# Altium schematic sheet Sheet2 .SchDoc
size A2; SheetNumber: 1; SheetTotal: 1; SPICEModelCacheZPAMZGEW: <root> / <DocumentId>ZPAMZGEW</DocumentId> / </root>
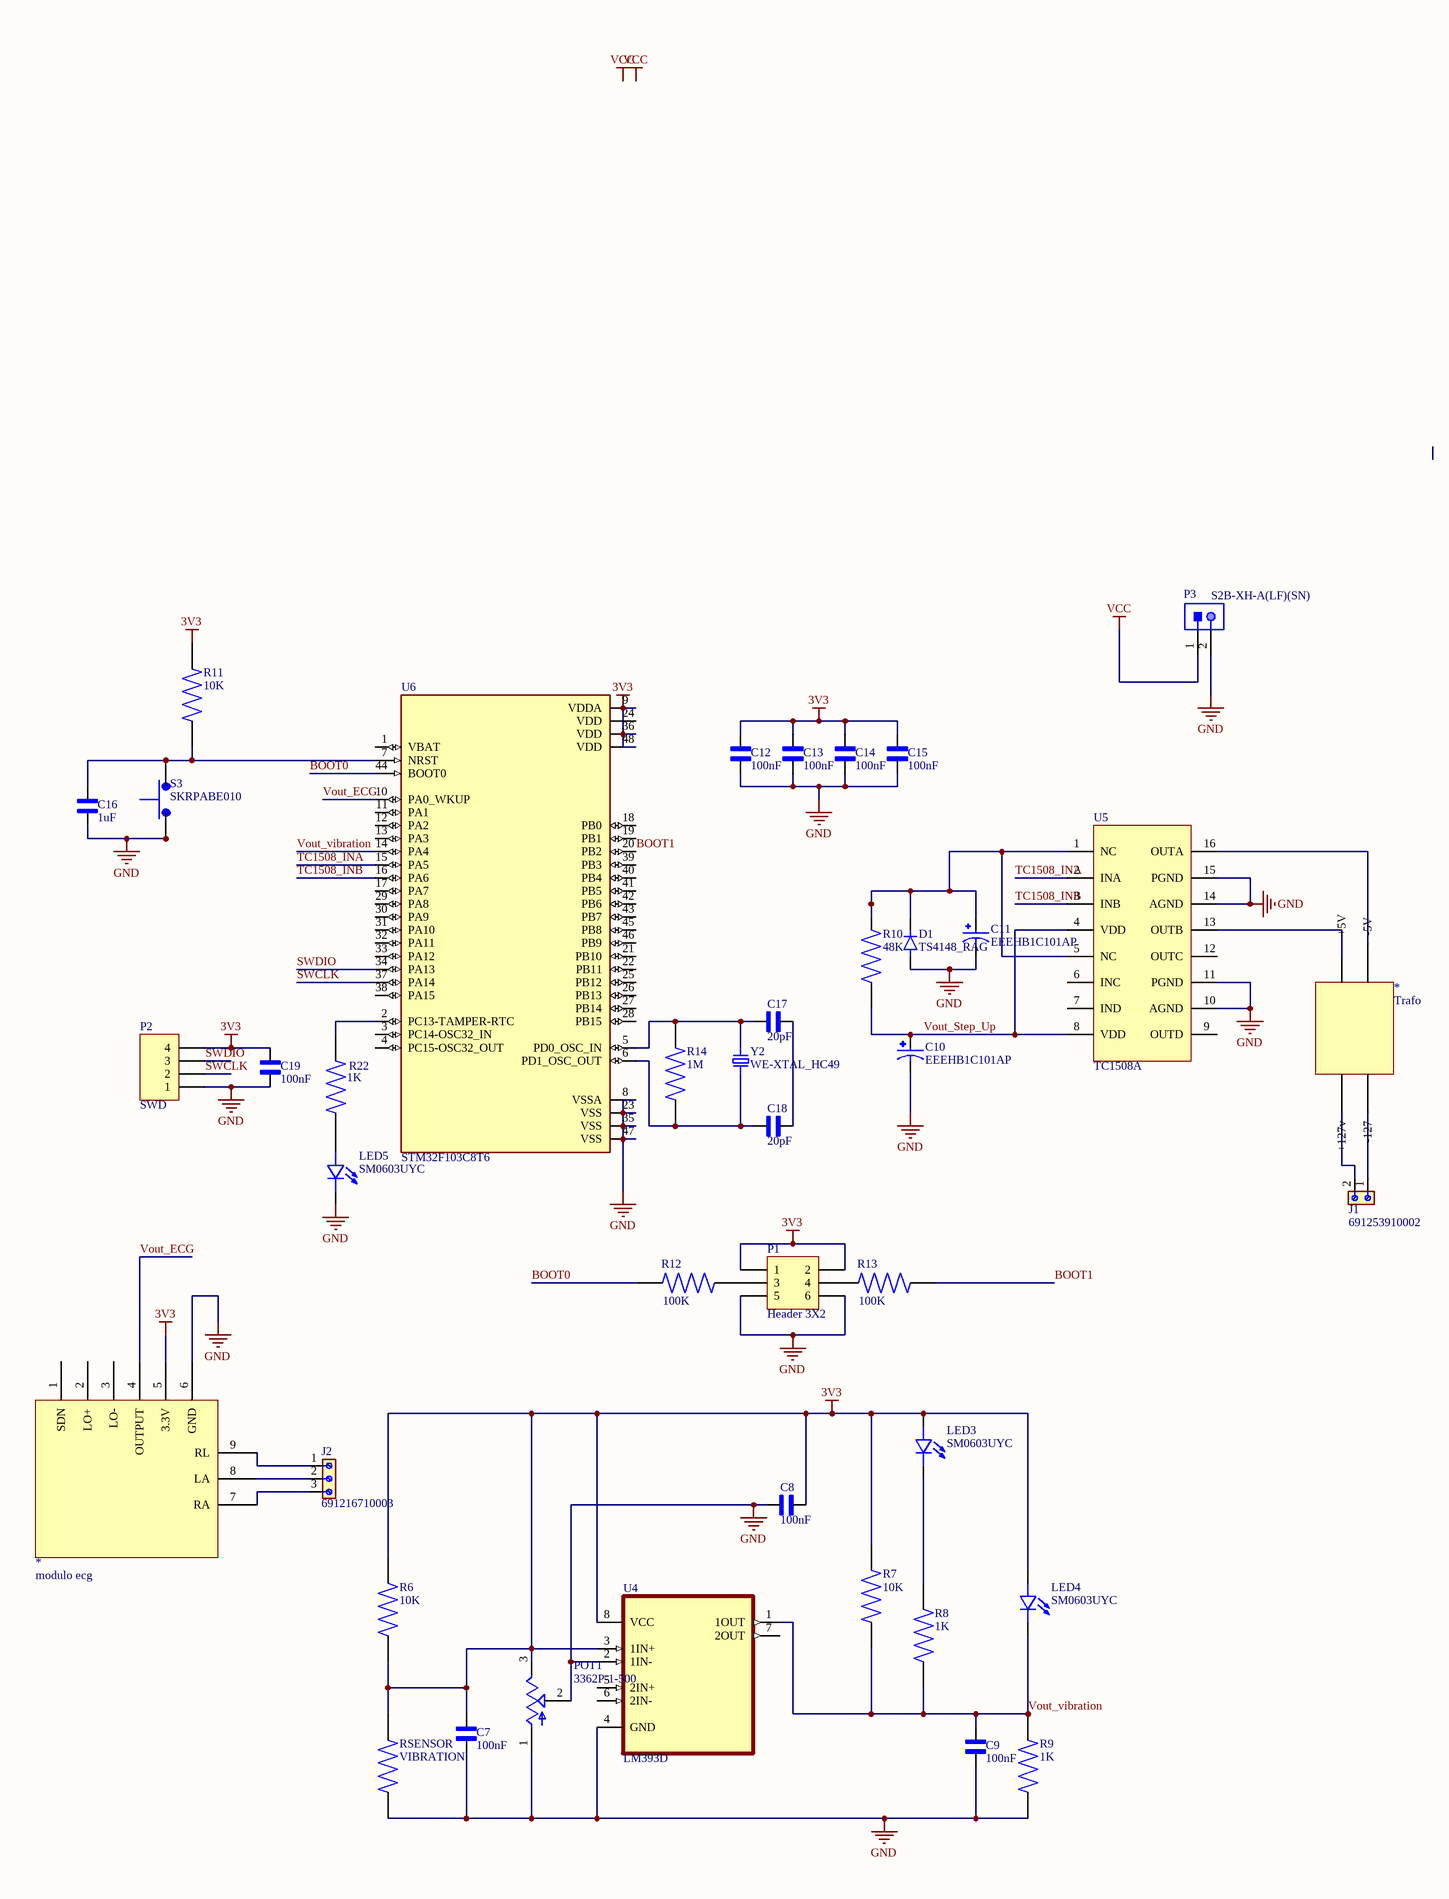
[diagram p0: Sheet2 .SchDoc, left]
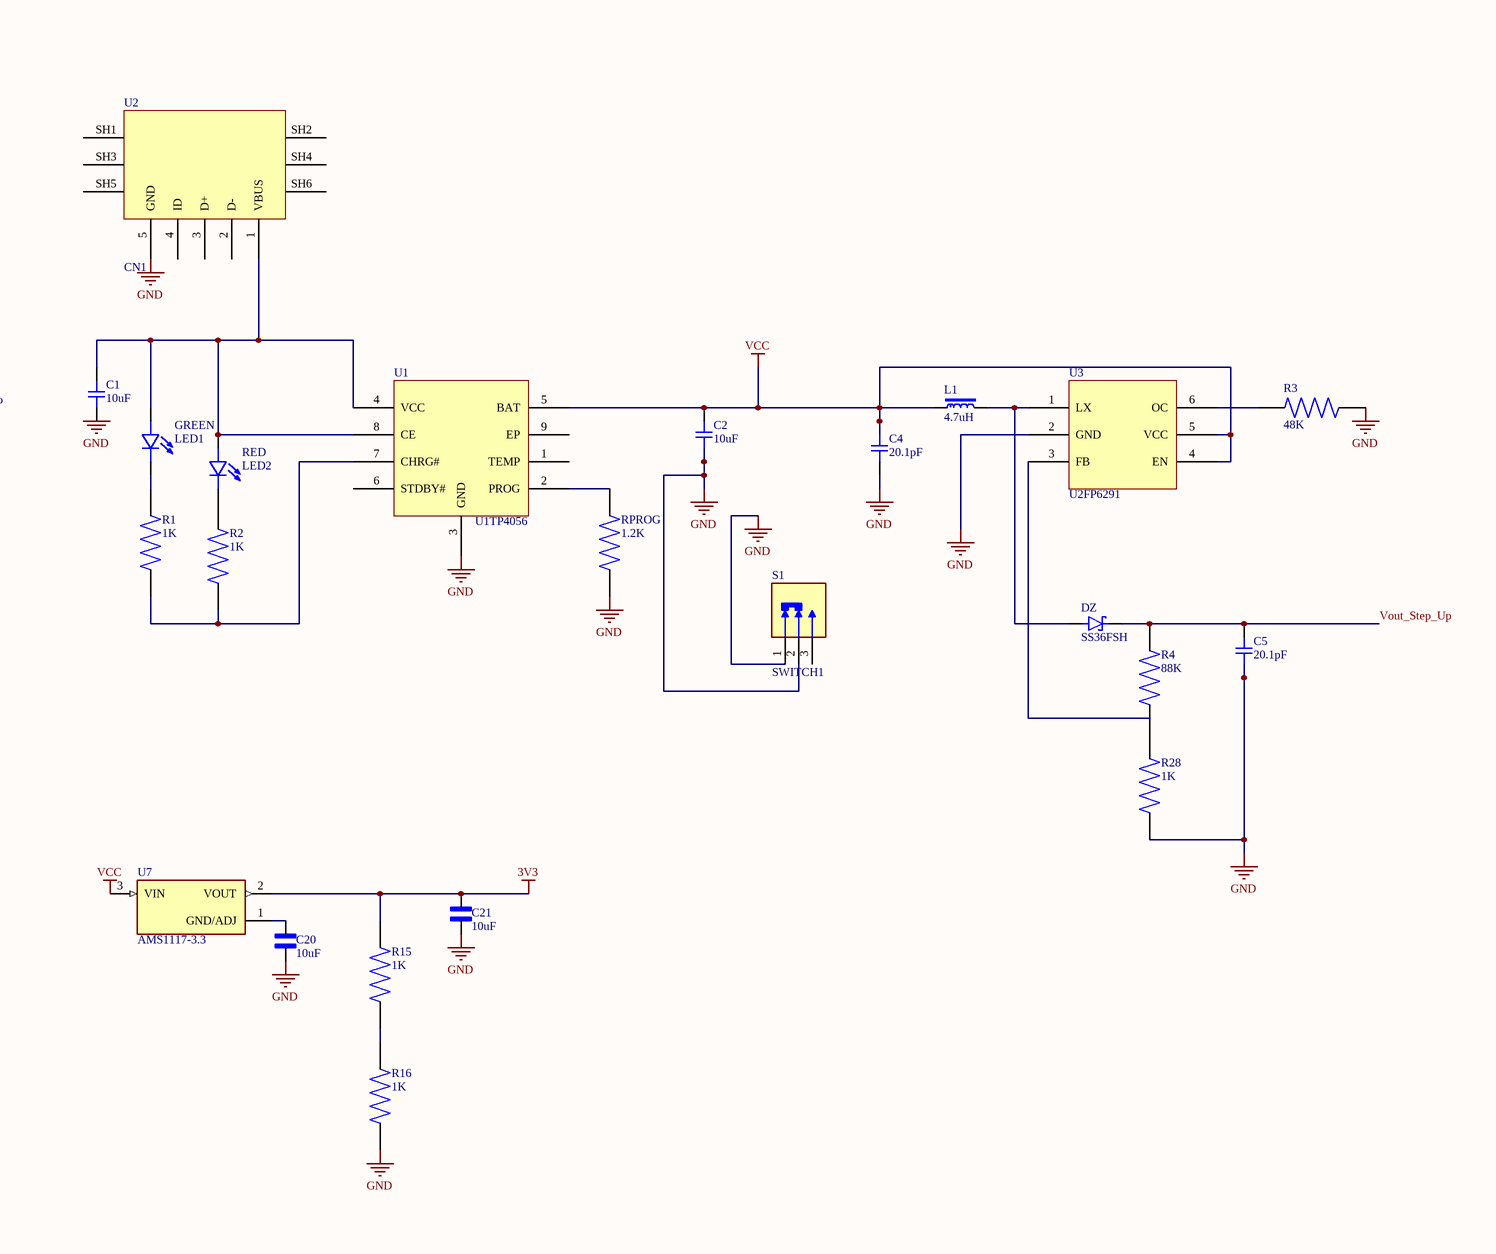
[diagram p1: Sheet2 .SchDoc, right]

## Parts
(Parts that share a designator on the sheet are numbered #1, #2 ... from top to bottom, then left to right.)
*#1  Trafo
*#2  modulo ecg  [MODULE_SEN-12650]
C1  10uF  [CAPC3216X190N]
C2  10uF  [CAPC3216X190N]
C4  20.1pF  [CAPC3216X190N]
C5  20.1pF  [CAPC3216X190N]
C7  100nF  [CAPC2012X94N]
C8  100nF  [CAPC2012X94N]
C9  100nF  [CAPC2012X94N]
C10  EEEHB1C101AP  [EHB1C10A3]
C11  EEEHB1C101AP  [EHB1C10A3]
C12  100nF  [CAPC2012X94N]
C13  100nF  [CAPC2012X94N]
C14  100nF  [CAPC2012X94N]
C15  100nF  [CAPC2012X94N]
C16  1uF  [CAPC2012X94N]
C17  20pF  [CAPC2012X94N]
C18  20pF  [CAPC2012X94N]
C19  100nF  [CAPC2012X94N]
C20  10uF  [CAPC2012X94N]
C21  10uF  [CAPC2012X94N]
D1  TS4148_RAG  [DIO_TS4148_RAG]
DZ  SS36FSH  [DIO]
GREEN  LED1  [LED_SM0603UYC]
J1  691253910002  [691253910002]
J2  691216710003  [691216710003]
L1  4.7uH  [INDC6060X300]
LED3  SM0603UYC  [LED_SM0603UYC]
LED4  SM0603UYC  [LED_SM0603UYC]
LED5  SM0603UYC  [LED_SM0603UYC]
P1  Header 3X2  [HDR2X3]
P2  SWD  [HDR1X4]
P3  S2B-XH-A(LF)(SN)  [JST-S2B-XH-A(LF)(SN)_V]
POT1  3362P-1-500  [TRIM_3362P-1-500]
R1  1K  [RESC2012X60N]
R2  1K  [RESC2012X60N]
R3  48K  [RESC2012X60N]
R4  88K  [RESC2012X60N]
R6  10K  [RESC2012X60N]
R7  10K  [RESC2012X60N]
R8  1K  [RESC2012X60N]
R9  1K  [RESC2012X60N]
R10  48K  [RESC2012X60N]
R11  10K  [RESC2012X60N]
R12  100K  [RESC2012X60N]
R13  100K  [RESC2012X60N]
R14  1M  [RESC2012X60N]
R15  1K  [RESC2012X60N]
R16  1K  [RESC2012X60N]
R22  1K  [RESC2012X60N]
R28  1K  [RESC2012X60N]
RED  LED2  [LED_SM0603UYC]
RPROG  1.2K  [RESC2012X60N]
RSENSOR  VIBRATION  [RESAD1520W70L1030D380]
S1  SWITCH1  [SW_SLW-116641-5A-S-D]
S3  SKRPABE010  [SW_SKRPABE010]
U1  U1TP4056  [SOIC127P600X175-8N]
U2  CN1  [GCT_USB3075-30-A]
U3  U2FP6291  [IC_IC-DP_SOT23-6L]
U4  LM393D  [SOIC127P600X175-8N]
U5  TC1508A  [SOIC127P600X175-16N]
U6  STM32F103C8T6  [QFP50P900X900X160-48N]
U7  AMS1117-3.3  [SOT229P700X180-4N]
Y2  WE-XTAL_HC49  [WE-XTAL_HC49]

## Nets
3V3: *#2.5(3.3V) C7.2 C8.1 C12.2 C13.2 C14.2 C15.2 C19.2 C21.2 LED3.A LED4.A P1.1 P1.2 P2.4 POT1.3(CW) R6.1 R6.2 R7.2 R11.2 R15.2 RSENSOR.2 U4.3(1IN+) U4.8(VCC) U6.9(VDDA) U6.36(VDD) U6.48(VDD) U7.2(VOUT)
GND: *#2.6(GND) C2.2(B) C4.2(B) C5.2(B) C7.1 C8.2 C9.1 C10.2 C11.2 C12.1 C13.1 C14.1 C15.1 C16.1 C19.1 C20.1 C21.1 D1.A LED5.C P1.5 P1.6 P2.1 P3.2 POT1.1(CCW) POT1.2(WIPER) R3.1 R9.1 R16.1 R28.1 RPROG.1 RSENSOR.1 S1.1 S1.2 S3.1 S3.2 U1.3(GND) U2.5(GND) U3.2(GND) U4.2(1IN-) U4.4(GND) U5.10(AGND) U5.11(PGND) U5.14(AGND) U5.15(PGND) U6.8(VSSA) U6.23(VSS) U6.35(VSS) U6.47(VSS)
VCC: C2.1(A) C4.1(A) L1.1 P3.1 U1.5(BAT) U3.4(EN) U3.5(VCC) U7.3(VIN)
BOOT0: R12.2 U6.44(BOOT0)
BOOT1: R13.1 U6.20(PB2)
SWCLK: P2.2 U6.37(PA14)
SWDIO: P2.3 U6.34(PA13)
TC1508_INA: U5.2(INA) U6.15(PA5)
TC1508_INB: U5.3(INB) U6.16(PA6)
Vout_ECG: *#2.4(OUTPUT) U6.10(PA0_WKUP)
Vout_Step_Up: C5.1(A) C10.1 DZ.C(K) R4.2 R10.2 U5.4(VDD) U5.8(VDD)
Vout_vibration: C9.2 LED4.C R7.1 R8.1 R9.2 U4.1(1OUT) U6.14(PA4)
Net*#2_7: *#2.7(RA) J2.3
Net*#2_8: *#2.8(LA) J2.2
Net*#2_9: *#2.9(RL) J2.1
NetC1_1: C1.1(A) GREEN.A RED.A U1.4(VCC) U1.8(CE) U2.1(VBUS)
NetC11_1: C11.1 D1.C(K) R10.1 U5.1(NC) U5.5(NC)
NetC16_2: C16.2 R11.1 S3.3 S3.4 U6.7(NRST)
NetC17_1: C17.1 C18.1
NetC17_2: C17.2 R14.1 U6.5(PD0_OSC_IN) Y2.2
NetC18_2: C18.2 R14.2 U6.6(PD1_OSC_OUT) Y2.1
NetC20_2: C20.2 U7.1(GND/ADJ)
NetDZ_A: DZ.A L1.2 U3.1(LX)
NetGREEN_C: GREEN.C R1.2
NetLED3_C: LED3.C R8.2
NetLED5_A: LED5.A R22.1
NetP1_3: P1.3 R12.1
NetR1_1: R1.1 R2.1 U1.7(CHRG#)
NetR2_2: R2.2 RED.C
NetR3_2: R3.2 U3.6(OC)
NetR4_1: R4.1 R28.2
NetR15_1: R15.1 R16.2
NetR22_2: R22.2 U6.2(PC13-TAMPER-RTC)
NetRPROG_2: RPROG.2 U1.2(PROG)

Not connected (* = marked no-connect by the designer): *#1 ?1(+5V) ?2(-5V) ?3(+127v) ?4(-127); *#2 1(SDN) 2(LO+) 3(LO-); C1 2(B); J1 1 2; P1 4; R13 2; S1 3; U1 1(TEMP) 6(STDBY#) 9(EP); U2 2(D-) 3(D+) 4(ID) SH1 SH2 SH3 SH4 SH5 SH6; U3 3(FB); U4 5(2IN+) 6(2IN-) 7(2OUT); U5 6(INC) 7(IND) 9(OUTD) 12(OUTC) 13(OUTB) 16(OUTA); U6 1(VBAT) 3(PC14-OSC32_IN) 4(PC15-OSC32_OUT) 11(PA1) 12(PA2) 13(PA3) 17(PA7) 18(PB0) 19(PB1) 21(PB10) 22(PB11) 24(VDD) 25(PB12) 26(PB13) 27(PB14) 28(PB15) 29(PA8) 30(PA9) 31(PA10) 32(PA11) 33(PA12) 38(PA15) 39(PB3) 40(PB4) 41(PB5) 42(PB6) 43(PB7) 45(PB8) 46(PB9)

## Notes on the sheet
- Labels drawn without touching a wire or pin: GND, VCC

## Library data of the parts
C1 C2 C4 C5 = C1206C105K5RACTU: 1206 C 1uF Ceramic Multilayer Capacitor, 50 VDC, +125degC, X7R Dielec, +/-10% | KEMET C1206C105K5RACTU; SnapEDA_Link: https://www.snapeda.com/parts/C1206C105K5RACTU/KEMET/view-part/?ref=snap; Package: 1206-2 KEMET; Value: *; MF: KEMET; MP: C1206C105K5RACTU; Check_prices: https://www.snapeda.com/parts/C1206C105K5RACTU/KEMET/view-part/?ref=eda
C7-C9 C12-C21 = 0805YC103J4T2A: 10000 pF Â±5% 16V Ceramic Capacitor X7R 0805 (2012 Metric); MF: AVX; SnapEDA_Link: https://www.snapeda.com/parts/0805YC103J4T2A/AVX/view-part/?ref=snap; Package: 2012 AVX; Value: *; MP: 0805YC103J4T2A; Check_prices: https://www.snapeda.com/parts/0805YC103J4T2A/AVX/view-part/?ref=eda
C10 C11 = EEEHB1C101AP: 100ÂµF 16V Aluminum Electrolytic Capacitors Radial, Can - SMD 2000 Hrs @ 105Â°C; MF: Panasonic; MP: EEE-HB1C101AP; SnapEDA_Link: https://www.snapeda.com/parts/EEE-HB1C101AP/Panasonic/view-part/?ref=snap; Package: RADIAL-2 Panasonic; Value: *; Check_prices: https://www.snapeda.com/parts/EEE-HB1C101AP/Panasonic/view-part/?ref=eda
D1 = TS4148_RAG: 1206 (Ceramics), 75V, 0.15A, Switching Diode & Array; MF: Taiwan Semiconductor; MP: TS4148 RAG; SnapEDA_Link: https://www.snapeda.com/parts/TS4148%20RAG/Taiwan+Semiconductor/view-part/?ref=snap; Package: 1206-2 Taiwan Semiconductor; Value: *; Check_prices: https://www.snapeda.com/parts/TS4148%20RAG/Taiwan+Semiconductor/view-part/?ref=eda
DZ = SS36FSH: 3A, 60V, Schottky Rectifier; MF: Taiwan Semiconductor; SnapEDA_Link: https://www.snapeda.com/parts/SS36FSH/Taiwan+Semiconductor/view-part/?ref=snap; Package: SOD-128-2 Taiwan Semiconductor; Value: *; MP: SS36FSH; Check_prices: https://www.snapeda.com/parts/SS36FSH/Taiwan+Semiconductor/view-part/?ref=eda
GREEN LED3-LED5 RED = SM0603UYC: LED SMD 0603 Ultra Yellow 593nm 70mcd Water Clear Lens 130 Deg Viewing Angle | Bivar Inc. SM0603UYC; SnapEDA_Link: https://www.snapeda.com/parts/SM0603UYC/Bivar/view-part/?ref=snap; Package: 0603 Bivar; Value: *; MF: Bivar; MP: SM0603UYC; Check_prices: https://www.snapeda.com/parts/SM0603UYC/Bivar/view-part/?ref=eda
J1 = 691253910002: 7.50 MM TERMINAL BLOCK;; MF: WÃ¼rth Elektronik; SnapEDA_Link: https://www.snapeda.com/parts/691253910002/W%25C3%25BCrth+Elektronik+Midcom/view-part/?ref=snap; Package: None; Value: *; MP: 691253910002; Check_prices: https://www.snapeda.com/parts/691253910002/W%25C3%25BCrth+Elektronik+Midcom/view-part/?ref=eda
J2 = 691216710003: 5.00 MM TERMINAL BLOCK;; MF: WÃ¼rth Elektronik; SnapEDA_Link: https://www.snapeda.com/parts/691216710003/W%25C3%25BCrth+Elektronik+Midcom/view-part/?ref=snap; Package: None; Value: *; MP: 691216710003; Check_prices: https://www.snapeda.com/parts/691216710003/W%25C3%25BCrth+Elektronik+Midcom/view-part/?ref=eda
L1 = CSAB0630-100M: SMD Inductor 10uH-20%-5A; MF: Codaca; SnapEDA_Link: https://www.snapeda.com/parts/CSAB0630-100M/Codaca/view-part/?ref=snap; Package: None; Value: *; MP: CSAB0630-100M; Check_prices: https://www.snapeda.com/parts/CSAB0630-100M/Codaca/view-part/?ref=eda
P1 = Header 3X2: Header, 3-Pin, Dual row; LatestRevisionDate: 17-Jul-2002; LatestRevisionNote: Re-released for DXP Platform.; Publisher: Altium Limited
P2 = Header 4: Header, 4-Pin; LatestRevisionDate: 17-Jul-2002; LatestRevisionNote: Re-released for DXP Platform.; Publisher: Altium Limited
P3 = CMP-002-00032-2: Male Header, Pitch 2.5 mm, 1 x 2 Position, Height 6.1 mm, Tail Length 3.4 mm, -25 to 85 degC, RoHS, Bulk; Manufacturer: JST; Case/Package: S2B-XH-A(LF)(SN); Package Description: XH Series Disconnectable Crimp Style Connector, Pitch 2.5 mm, 1 x 2 Position, Height 6.1 mm, Tail Length 3.4 mm; Manufacturer URL: http://www.jst.com/home2.html; Datasheet URL: http://www.jst-mfg.com/product/pdf/eng/eXH.pdf; Connector Type: Header; Package Reference: S2B-XH-A(LF)(SN); Mounting Technology: TH; Max Operating Temperature: 85°C; Min Operating Temperature: -25°C; Datasheet Version: May-16; Gender: Male; RoHS Compliant: Unknown
POT1 = 3362P-1-500: 50 Ohms 0.5W, 1/2W PC Pins Through Hole Trimmer Potentiometer Cermet 1 Turn Top Adjustment; MF: Bourns; Purchase-URL: https://pricing.snapeda.com/search/part/3362P-1-500/?ref=eda; SnapEDA_Link: https://www.snapeda.com/parts/3362P-1-500/Bourns/view-part/1483648/?ref=snap; Value: *; MP: 3362P-1-500; Check_prices: https://www.snapeda.com/parts/3362P-1-500/Bourns/view-part/1483648/?ref=eda; Package: 3362P-1 Bourns Inc.; Price: None; Availability: Warning
R1-R4 R6-R16 R22 R28 RPROG = RC0805FR-07330RL: 330 Ohms Â±1% 0.125W, 1/8W Chip Resistor 0805 (2012 Metric) Moisture Resistant Thick Film; MF: Yageo; SnapEDA_Link: https://www.snapeda.com/parts/RC0805FR-07330RL/Yageo/view-part/?ref=snap; Package: 2012 Yageo; Value: *; MP: RC0805FR-07330RL; Check_prices: https://www.snapeda.com/parts/RC0805FR-07330RL/Yageo/view-part/?ref=eda
RSENSOR = CBT50J5R1: 5.1 Ohms Â±5% 0.5W, 1/2W Through Hole Resistor Axial Pulse Withstanding Carbon Composition; MF: TE Connectivity / AMP; Price: None; Availability: In Stock; Package: Axial TE Connectivity / AMP; MP: CBT50J5R1; Value: *; SnapEDA_Link: https://www.snapeda.com/parts/CBT50J5R1/TE+Connectivity+%252F+AMP/view-part/?ref=snap; Purchase-URL: https://pricing.snapeda.com/search/part/CBT50J5R1/?ref=eda; Check_prices: https://www.snapeda.com/parts/CBT50J5R1/TE+Connectivity+%252F+AMP/view-part/?ref=eda
S1 = SLW-116641-5A-S-D: 11.6 x 6 x 4.1 mm, 5 mm Raised Slide Actuator, Through Hole, Slide Switch; MF: Same Sky; SnapEDA_Link: https://www.snapeda.com/parts/SLW-116641-5A-S-D/Same+Sky/view-part/?ref=snap; Package: Package; Value: *; MP: SLW-116641-5A-S-D; Check_prices: https://www.snapeda.com/parts/SLW-116641-5A-S-D/Same+Sky/view-part/?ref=eda
S3 = SKRPABE010: Switch Tactile N.O. SPST Button J-Bend 0.05A 16VDC 1.57N SMD Automotive T/R; MF: ALPS; SnapEDA_Link: https://www.snapeda.com/parts/SKRPABE010/ALPS/view-part/?ref=snap; Package: None; Value: *; MP: SKRPABE010; Check_prices: https://www.snapeda.com/parts/SKRPABE010/ALPS/view-part/?ref=eda
U4 = LM393D: Comparator General Purpose CMOS, DTL, ECL, MOS, Open-Collector, TTL 8-SOIC; MF: STMicroelectronics; SnapEDA_Link: https://www.snapeda.com/parts/LM393D/STMicroelectronics/view-part/?ref=snap; Package: SOIC-8 STMicroelectronics; Value: *; MP: LM393D; Check_prices: https://www.snapeda.com/parts/LM393D/STMicroelectronics/view-part/?ref=eda
U6 = STM32F103C8T6: ARM® Cortex®-M3 STM32F1 Microcontroller IC 32-Bit 72MHz 64KB (64K x 8) FLASH 48-LQFP (7x7); MF: STMicroelectronics; SnapEDA_Link: https://www.snapeda.com/parts/STM32F103C8T6/STMicroelectronics/view-part/?ref=snap; Package: LQFP-48 STMicroelectronics; Value: *; MP: STM32F103C8T6; Check_prices: https://www.snapeda.com/parts/STM32F103C8T6/STMicroelectronics/view-part/?ref=eda
U7 = AMS1117-3.3: Sot223/Pkg 1-Amp 3.3-Volt Low Drop Out Voltage Regulatator; MF: Advanced Monolithic Systems; SnapEDA_Link: https://www.snapeda.com/parts/AMS1117-3.3/Advanced+Monolithic+Systems/view-part/?ref=snap; Package: SOT-223 Seeed Technology; Value: *; MP: AMS1117-3.3; Check_prices: https://www.snapeda.com/parts/AMS1117-3.3/Advanced+Monolithic+Systems/view-part/?ref=eda
Y2 = WE-XTAL_HC49: MF: {'manufacturer': u'W\xfcrth Elektronik'}; MP: 830003033B; Package: None; Price: None; Value: *; Availability: Unavailable